# EAGLE design type-1 4 button v4 (EAGLE 9.6.2)
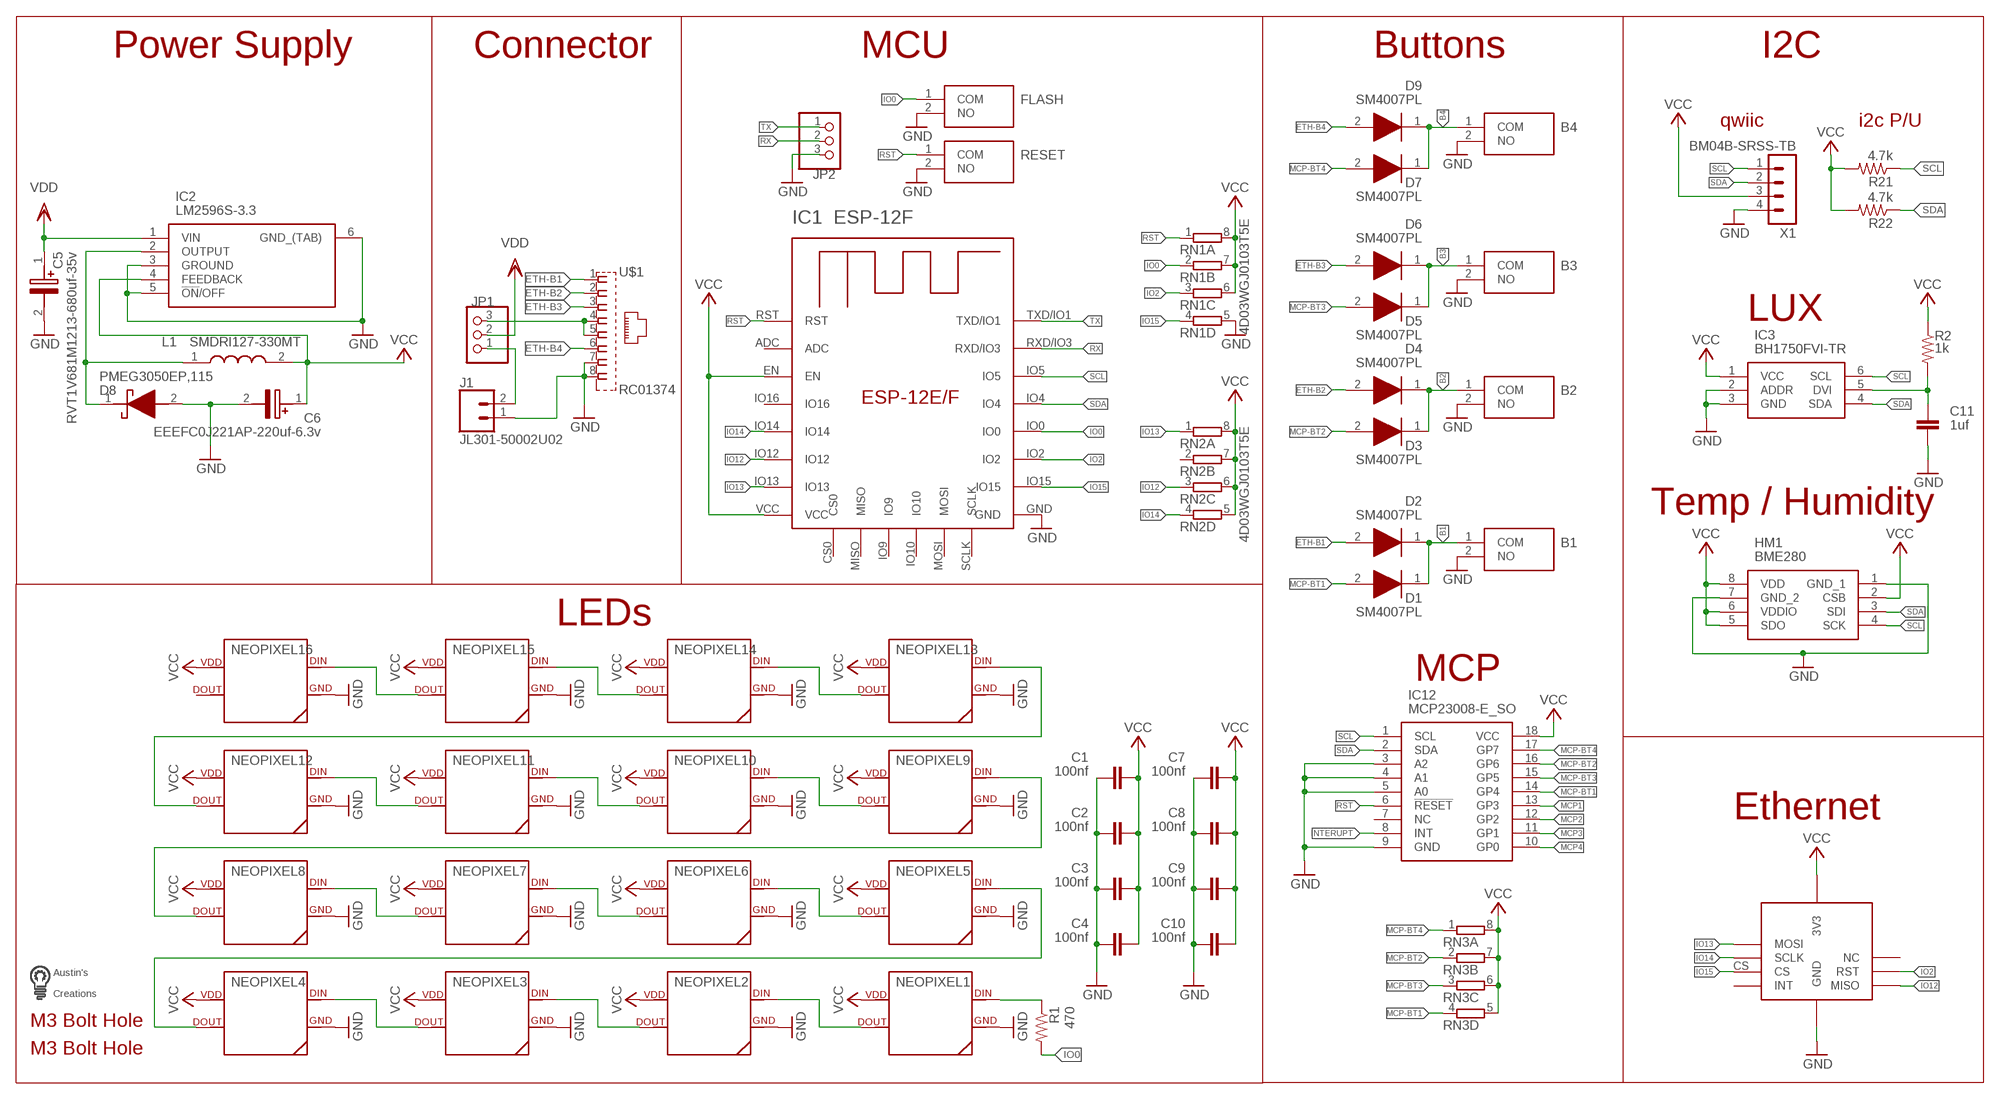
[diagram p0: schematic, sheet 1]

## Parts
B1  PTS636_SM25F_SMTR_LFS  [PTS636SM25FSMTRLFS]
B2  PTS636_SM25F_SMTR_LFS  [PTS636SM25FSMTRLFS]
B3  PTS636_SM25F_SMTR_LFS  [PTS636SM25FSMTRLFS]
B4  PTS636_SM25F_SMTR_LFS  [PTS636SM25FSMTRLFS]
C1  100nf  C-EUC0603  [C0603]
C2  100nf  C-EUC0603  [C0603]
C3  100nf  C-EUC0603  [C0603]
C4  100nf  C-EUC0603  [C0603]
C5  RVT1V681M1213-680uf-35v  EEE-HD1V681AQ  [CAPAE1350X1400N]
C6  EEEFC0J221AP-220uf-6.3v  EEEFC0J221AP  [CAPAE830X650N]
C7  100nf  C-EUC0603  [C0603]
C8  100nf  C-EUC0603  [C0603]
C9  100nf  C-EUC0603  [C0603]
C10  100nf  C-EUC0603  [C0603]
C11  1uf  C-EUC0603  [C0603]
D1  SM4007PL  [SODFL3718X125N]
D2  SM4007PL  [SODFL3718X125N]
D3  SM4007PL  [SODFL3718X125N]
D4  SM4007PL  [SODFL3718X125N]
D5  SM4007PL  [SODFL3718X125N]
D6  SM4007PL  [SODFL3718X125N]
D7  SM4007PL  [SODFL3718X125N]
D8  PMEG3050EP,115  [PMEG3050EP115]
D9  SM4007PL  [SODFL3718X125N]
FLASH  PTS636_SM25F_SMTR_LFS  [PTS636SM25FSMTRLFS]
HM1  BME280  [BME280]
IC1  ESP-12F  ESP-12E/F  [ESP-12E]
IC2  LM2596S-3.3  LM2596S-3.3_NOPB  [TO170P1435X465-6N]
IC3  BH1750FVI-TR  [WSOF6]
IC12  MCP23008-E_SO  [SOIC127P1030X265-18N]
J1  JL301-50002U02  2PINBLOCK  [SCREWTERMINAL-5MM-2]
JP1  PINHD-1X3  [1X03]
JP2  PINHD-1X3  [1X03]
L1  SMDRI127-330MT  CDRH127_LDNP-330MC  [INDPM120120X800N]
NEOPIXEL1  SK6812NEOPIXEL5050  [SK6812]
NEOPIXEL2  SK6812NEOPIXEL5050  [SK6812]
NEOPIXEL3  SK6812NEOPIXEL5050  [SK6812]
NEOPIXEL4  SK6812NEOPIXEL5050  [SK6812]
NEOPIXEL5  SK6812NEOPIXEL5050  [SK6812]
NEOPIXEL6  SK6812NEOPIXEL5050  [SK6812]
NEOPIXEL7  SK6812NEOPIXEL5050  [SK6812]
NEOPIXEL8  SK6812NEOPIXEL5050  [SK6812]
NEOPIXEL9  SK6812NEOPIXEL5050  [SK6812]
NEOPIXEL10  SK6812NEOPIXEL5050  [SK6812]
NEOPIXEL11  SK6812NEOPIXEL5050  [SK6812]
NEOPIXEL12  SK6812NEOPIXEL5050  [SK6812]
NEOPIXEL13  SK6812NEOPIXEL5050  [SK6812]
NEOPIXEL14  SK6812NEOPIXEL5050  [SK6812]
NEOPIXEL15  SK6812NEOPIXEL5050  [SK6812]
NEOPIXEL16  SK6812NEOPIXEL5050  [SK6812]
R1  470  R-US_R0603  [R0603]
R2  1k  R-US_R0603  [R0603]
R21  4.7k  R-US_R0603  [R0603]
R22  4.7k  R-US_R0603  [R0603]
RESET  PTS636_SM25F_SMTR_LFS  [PTS636SM25FSMTRLFS]
RN1  4R-N0603-ARC  [0603-ARC]
RN2  4R-N0603-ARC  [0603-ARC]
RN3  4R-N0603-ARC  [0603-ARC]
U$1  RC01374  [RC01374]
U$3  W5500MODULE  [W5500MODULE]
U$4  M3BOLTHOLE  [M3BOLTHOLE]
U$5  M3BOLTHOLE  [M3BOLTHOLE]
U$6  LOGOMED  [LOGOMED]
X1  BM04B-SRSS-TB  [BM04B-SRSS-TB]

## Nets
B1: B1.1(COM) D1.1(K) D2.1(K)
B2: B2.1(COM) D3.1(K) D4.1(K)
B3: B3.1(COM) D5.1(K) D6.1(K)
B4: B4.1(COM) D7.1(K) D9.1(K)
ETH-B1: D2.2(A) U$1.1
ETH-B2: D4.2(A) U$1.2
ETH-B3: D6.2(A) U$1.3
ETH-B4: D9.2(A) U$1.6
GND: B1.2(NO) B2.2(NO) B3.2(NO) B4.2(NO) C1.1 C2.1 C3.1 C4.1 C5.2(-) C6.2(-) C7.1 C8.1 C9.1 C10.1 C11.2 D8.2(A) FLASH.2(NO) HM1.1(GND_1) HM1.7(GND_2) IC1.GND IC2.3(GROUND) IC2.5(!ON!/OFF) IC2.6(GND_(TAB)) IC3.2(ADDR) IC3.3(GND) IC12.3(A2) IC12.4(A1) IC12.5(A0) IC12.9(GND) J1.1 JP2.3 NEOPIXEL1.3(GND) NEOPIXEL2.3(GND) NEOPIXEL3.3(GND) NEOPIXEL4.3(GND) NEOPIXEL5.3(GND) NEOPIXEL6.3(GND) NEOPIXEL7.3(GND) NEOPIXEL8.3(GND) NEOPIXEL9.3(GND) NEOPIXEL10.3(GND) NEOPIXEL11.3(GND) NEOPIXEL12.3(GND) NEOPIXEL13.3(GND) NEOPIXEL14.3(GND) NEOPIXEL15.3(GND) NEOPIXEL16.3(GND) RESET.2(NO) RN1.5 U$1.7 U$1.8 U$3.GND1(GND) U$3.GND2(GND) U$3.GND3(GND) X1.4
INTERUPT: IC12.8(INT)
IO0: FLASH.1(COM) IC1.IO0 R1.2 RN1.2
IO2: IC1.IO2 RN1.3 U$3.RST
IO12: IC1.IO12 RN2.3 U$3.MISO
IO13: IC1.IO13 RN2.1 U$3.MOSI
IO14: IC1.IO14 RN2.4 U$3.SCLK
IO15: IC1.IO15 RN1.4 U$3.CS
MCP1: IC12.13(GP3)
MCP2: IC12.12(GP2)
MCP3: IC12.11(GP1)
MCP4: IC12.10(GP0)
MCP-BT1: D1.2(A) IC12.14(GP4) RN3.4
MCP-BT2: D3.2(A) IC12.16(GP6) RN3.2
MCP-BT3: D5.2(A) IC12.15(GP5) RN3.3
MCP-BT4: D7.2(A) IC12.17(GP7) RN3.1
N$1: NEOPIXEL1.4(DIN) R1.1
N$2: NEOPIXEL1.2(DOUT) NEOPIXEL2.4(DIN)
N$3: NEOPIXEL2.2(DOUT) NEOPIXEL3.4(DIN)
N$4: NEOPIXEL3.2(DOUT) NEOPIXEL4.4(DIN)
N$5: NEOPIXEL4.2(DOUT) NEOPIXEL5.4(DIN)
N$6: NEOPIXEL8.2(DOUT) NEOPIXEL9.4(DIN)
N$7: NEOPIXEL12.2(DOUT) NEOPIXEL13.4(DIN)
N$8: NEOPIXEL5.2(DOUT) NEOPIXEL6.4(DIN)
N$9: NEOPIXEL9.2(DOUT) NEOPIXEL10.4(DIN)
N$10: NEOPIXEL13.2(DOUT) NEOPIXEL14.4(DIN)
N$11: NEOPIXEL6.2(DOUT) NEOPIXEL7.4(DIN)
N$12: NEOPIXEL10.2(DOUT) NEOPIXEL11.4(DIN)
N$13: NEOPIXEL14.2(DOUT) NEOPIXEL15.4(DIN)
N$14: NEOPIXEL7.2(DOUT) NEOPIXEL8.4(DIN)
N$15: NEOPIXEL11.2(DOUT) NEOPIXEL12.4(DIN)
N$16: NEOPIXEL15.2(DOUT) NEOPIXEL16.4(DIN)
N$17: JP1.3 U$1.4 U$1.5
N$18: J1.2 JP1.1
N$20: D8.1(K) IC2.2(OUTPUT) L1.1
N$21: C11.1 IC3.5(DVI) R2.2
RST: IC1.RST IC12.6(!RESET) RESET.1(COM) RN1.1
RX: IC1.RXD/IO3 JP2.2
SCL: HM1.4(SCK) IC1.IO5 IC3.6(SCL) IC12.1(SCL) R21.1 X1.1
SDA: HM1.3(SDI) IC1.IO4 IC3.4(SDA) IC12.2(SDA) R22.1 X1.2
TX: IC1.TXD/IO1 JP2.1
VCC: C1.2 C2.2 C3.2 C4.2 C6.1(+) C7.2 C8.2 C9.2 C10.2 HM1.2(CSB) HM1.5(SDO) HM1.6(VDDIO) HM1.8(VDD) IC1.EN IC1.VCC IC2.4(FEEDBACK) IC3.1(VCC) IC12.18(VCC) L1.2 NEOPIXEL1.1(VDD) NEOPIXEL2.1(VDD) NEOPIXEL3.1(VDD) NEOPIXEL4.1(VDD) NEOPIXEL5.1(VDD) NEOPIXEL6.1(VDD) NEOPIXEL7.1(VDD) NEOPIXEL8.1(VDD) NEOPIXEL9.1(VDD) NEOPIXEL10.1(VDD) NEOPIXEL11.1(VDD) NEOPIXEL12.1(VDD) NEOPIXEL13.1(VDD) NEOPIXEL14.1(VDD) NEOPIXEL15.1(VDD) NEOPIXEL16.1(VDD) R2.1 R21.2 R22.2 RN1.6 RN1.7 RN1.8 RN2.5 RN2.6 RN2.7 RN2.8 RN3.5 RN3.6 RN3.7 RN3.8 U$3.3V3_1(3V3) U$3.3V3_2(3V3) X1.3
VDD: C5.1(+) IC2.1(VIN) JP1.2
Unconnected: IC1.ADC IC1.CS0 IC1.IO9 IC1.IO10 IC1.IO16 IC1.MISO IC1.MOSI IC1.SCLK IC12.7(NC) NEOPIXEL16.2(DOUT) RN2.2 U$3.INT U$3.NC

## Notes on the sheet
- Power Supply | Connector | MCU | Buttons | I2C
- qwiic | i2c P/U
- LUX
- 4D03WGJ0103T5E
- Temp / Humidity
- 4D03WGJ0103T5E
- LEDs
- MCP
- Ethernet

## Library data of the parts
B1-B4 FLASH RESET = SamacSys_Parts:PTS636_SM25F_SMTR_LFS: Tactile Switches Tact 50mA 12VDC, 6.0x3.5, 2.5mm H, 180gf, F leads, No ground pin, White Actuator Source: Datasheet <https://ms.componentsearchengine.com/Datasheets/1/PTS636 SM25F SMTR LFS.pdf>; ARROW_PART_NUMBER: PTS636 SM25F SMTR LFS; ARROW_PRICE-STOCK: https://www.arrow.com/en/products/pts636-sm25f-smtr-lfs/ck; DESCRIPTION: Tactile Switches Tact 50mA 12VDC, 6.0x3.5, 2.5mm H, 180gf, F leads, No ground pin, White Actuator; HEIGHT: 2.7mm; MANUFACTURER_NAME: C & K COMPONENTS; MANUFACTURER_PART_NUMBER: PTS636 SM25F SMTR LFS; MOUSER_PART_NUMBER: 611-PTS636SM25FSMTRL; MOUSER_PRICE-STOCK: https://www.mouser.co.uk/ProductDetail/CK/PTS636-SM25F-SMTR-LFS?qs=vLWxofP3U2wcBTQSwfMFOw%3D%3D
C1-C4 C7-C11 = rcl:C-EU: CAPACITOR, European symbol; SPICEPREFIX: C
C5 = SamacSys_Parts:EEE-HD1V681AQ: Aluminium Electrolytic Capacitors - SMD 35VDC 680uF 20% AEC-Q200 Source: Datasheet <https://industrial.panasonic.com/cdbs/www-data/pdf/RDE0000/ABA0000C1166.pdf>; DESCRIPTION: Aluminium Electrolytic Capacitors - SMD 35VDC 680uF 20% AEC-Q200; HEIGHT: 14mm; MANUFACTURER_NAME: Panasonic; MANUFACTURER_PART_NUMBER: EEE-HD1V681AQ; MOUSER_PART_NUMBER: 667-EEE-HD1V681AQ; MOUSER_PRICE-STOCK: https://www.mouser.co.uk/ProductDetail/Panasonic/EEE-HD1V681AQ?qs=w%2Fv1CP2dgqoW7i2Hoqi%252B9w%3D%3D
C6 = SamacSys_Parts:EEEFC0J221AP: PANASONIC - EEEFC0J221AP - SMD Aluminium Electrolytic Capacitor, Radial Can - SMD, 220 F, 6.3 V, EEEFC Series Source: Datasheet <https://industrial.panasonic.com/cdbs/www-data/pdf/RDE0000/ABA0000C1169.pdf>; DESCRIPTION: PANASONIC - EEEFC0J221AP - SMD Aluminium Electrolytic Capacitor, Radial Can - SMD, 220 F, 6.3 V, EEEFC Series; HEIGHT: 6.5mm; MANUFACTURER_NAME: Panasonic; MANUFACTURER_PART_NUMBER: EEEFC0J221AP
D1-D7 D9 = SamacSys_Parts:SM4007PL: 1kV 1A 1.1V @ 1A SOD-123FL Diodes - General Purpose RoHS Source: Datasheet <https://datasheet.lcsc.com/szlcsc/1903051030_MDD-Jiangsu-Yutai-Elec-SM4007PL_C64898.pdf>; DESCRIPTION: 1kV 1A 1.1V @ 1A SOD-123FL Diodes - General Purpose RoHS; HEIGHT: 1.25mm; MANUFACTURER_NAME: MDD(Microdiode Electronics); MANUFACTURER_PART_NUMBER: SM4007PL
D8 = SamacSys_Parts:PMEG3050EP,115: NXP PMEG3050EP,115 SMT Schottky Diode, 30V 5A, 2-Pin SOD-128 Source: Datasheet <https://docs-emea.rs-online.com/webdocs/14cd/0900766b814cd012.pdf>; ARROW_PART_NUMBER: PMEG3050EP,115; ARROW_PRICE-STOCK: https://www.arrow.com/en/products/pmeg3050ep115/nexperia; DESCRIPTION: NXP PMEG3050EP,115 SMT Schottky Diode, 30V 5A, 2-Pin SOD-128; HEIGHT: 1mm; MANUFACTURER_NAME: Nexperia; MANUFACTURER_PART_NUMBER: PMEG3050EP,115; MOUSER_PART_NUMBER: 771-PMEG3050EP115; MOUSER_PRICE-STOCK: https://www.mouser.co.uk/ProductDetail/Nexperia/PMEG3050EP115?qs=GcY6OjH1zdmnjQ%2FhUT5aOA%3D%3D
HM1 = custom parts:BME280: Board Mount Humidity Sensors Source: Datasheet <http://ae-bst.resource.bosch.com/media/products/dokumente/bme280/BST-BME280_DS001-11.pdf>; DESCRIPTION: Board Mount Humidity Sensors; HEIGHT: mm; MANUFACTURER_NAME: Bosch Sensortec; MANUFACTURER_PART_NUMBER: BME280; MOUSER_PART_NUMBER: 262-BME280; MOUSER_PRICE-STOCK: https://www.mouser.co.uk/ProductDetail/Bosch-Sensortec/BME280?qs=2OnyuXx6vpj2fK9HX7qb3g%3D%3D
IC1 = custom parts:ESP-12E/F
IC2 = SamacSys_Parts:LM2596S-3.3_NOPB: SIMPLE SWITCHER® 4.5V to 40V, 3A Low Component Count Step-Down Regulator Source: Datasheet <http://www.ti.com/lit/ds/symlink/lm2596.pdf>; DESCRIPTION: SIMPLE SWITCHER&#174; 4.5V to 40V, 3A Low Component Count Step-Down Regulator; HEIGHT: 4.65mm; MANUFACTURER_NAME: Texas Instruments; MANUFACTURER_PART_NUMBER: LM2596S-3.3/NOPB; MOUSER_PART_NUMBER: 926-LM2596S-3.3/NOPB; MOUSER_PRICE-STOCK: https://www.mouser.co.uk/ProductDetail/Texas-Instruments/LM2596S-33-NOPB?qs=X1J7HmVL2ZHsEwG9Q6doow%3D%3D
IC3 = custom parts:BH1750FVI-TR: Ambient Light Sensor,16bit,I2C,WSOF6I ROHM BH1750FVI-TR Ambient Light Sensor Unit Surface Mount Source: Datasheet <https://componentsearchengine.com/Datasheets/2/BH1750FVI-TR.pdf>; DESCRIPTION: Ambient Light Sensor,16bit,I2C,WSOF6I ROHM BH1750FVI-TR Ambient Light Sensor Unit Surface Mount; HEIGHT: mm; MANUFACTURER_NAME: ROHM Semiconductor; MANUFACTURER_PART_NUMBER: BH1750FVI-TR; MOUSER_PART_NUMBER: 755-BH1750FVI-TR; MOUSER_PRICE-STOCK: https://www.mouser.co.uk/ProductDetail/ROHM-Semiconductor/BH1750FVI-TR?qs=phc6PQ%252BTPUNy88lRCs6mVA%3D%3D
IC12 = SamacSys_Parts:MCP23008-E_SO: 8-bit I/O Expander,I2C,MCP23008-E/SO Source: Datasheet <http://docs-emea.rs-online.com/webdocs/0a78/0900766b80a784b7.pdf>; ARROW_PART_NUMBER: MCP23008-E/SO; ARROW_PRICE-STOCK: https://www.arrow.com/en/products/mcp23008-eso/microchip-technology; DESCRIPTION: 8-bit I/O Expander,I2C,MCP23008-E/SO; HEIGHT: 2.65mm; MANUFACTURER_NAME: Microchip; MANUFACTURER_PART_NUMBER: MCP23008-E/SO; MOUSER_PART_NUMBER: 579-MCP23008-E/SO; MOUSER_PRICE-STOCK: https://www.mouser.co.uk/ProductDetail/Microchip-Technology/MCP23008-E-SO?qs=Sez7gRs8XSWum74ZwQXTLw%3D%3D
J1 = custom parts:2PINBLOCK
JP1 JP2 = custom parts:PINHD-1X3: PIN HEADER
L1 = SamacSys_Parts:CDRH127_LDNP-330MC: Fixed Inductors 33uH 3.9A Source: Datasheet <https://products.sumida.com/products/pdf/CDRH127LD.pdf>; DESCRIPTION: Fixed Inductors 33uH 3.9A; HEIGHT: 8mm; MANUFACTURER_NAME: Sumida; MANUFACTURER_PART_NUMBER: CDRH127/LDNP-330MC; MOUSER_PART_NUMBER: 851-CDRH127LDNP330MC; MOUSER_PRICE-STOCK: https://www.mouser.co.uk/ProductDetail/Sumida/CDRH127-LDNP-330MC?qs=rZntyWl5IYHj3wgmnQ0WOg%3D%3D
NEOPIXEL1-NEOPIXEL16 = custom parts:SK6812: for 5050 sk6812 LED
R1 R2 = resistor:R-US_: RESISTOR, American symbol
R21 R22 = rcl:R-US_: RESISTOR, American symbol; SPICEPREFIX: R
RN1-RN3 = custom parts:4R-N: Array Chip Resistor Source: RS Component / Phycomp; OC_FARNELL: unknown; OC_NEWARK: unknown
U$1 = custom parts:RC01374
U$3 = custom parts:W5500MODULE
U$4 U$5 = custom parts:M3BOLTHOLE
U$6 = custom parts:LOGOMED
X1 = custom parts:BM04B-SRSS: JST SH series header 1.00mm pitch disconnectable crimp style connectors, vertical (side entry type), 4 pins

## Board
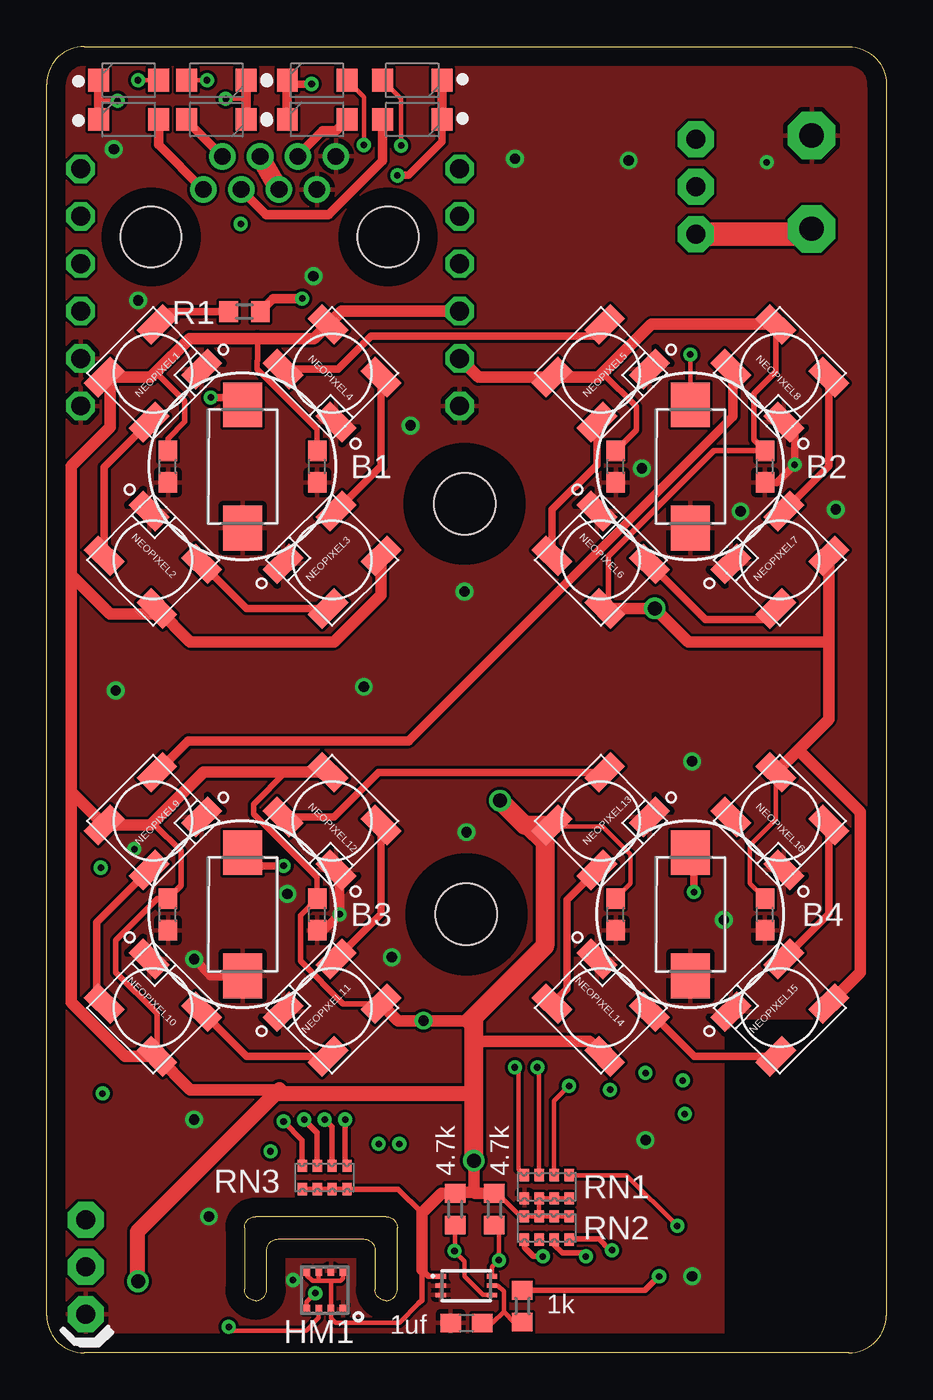
[diagram p1: board, top side]
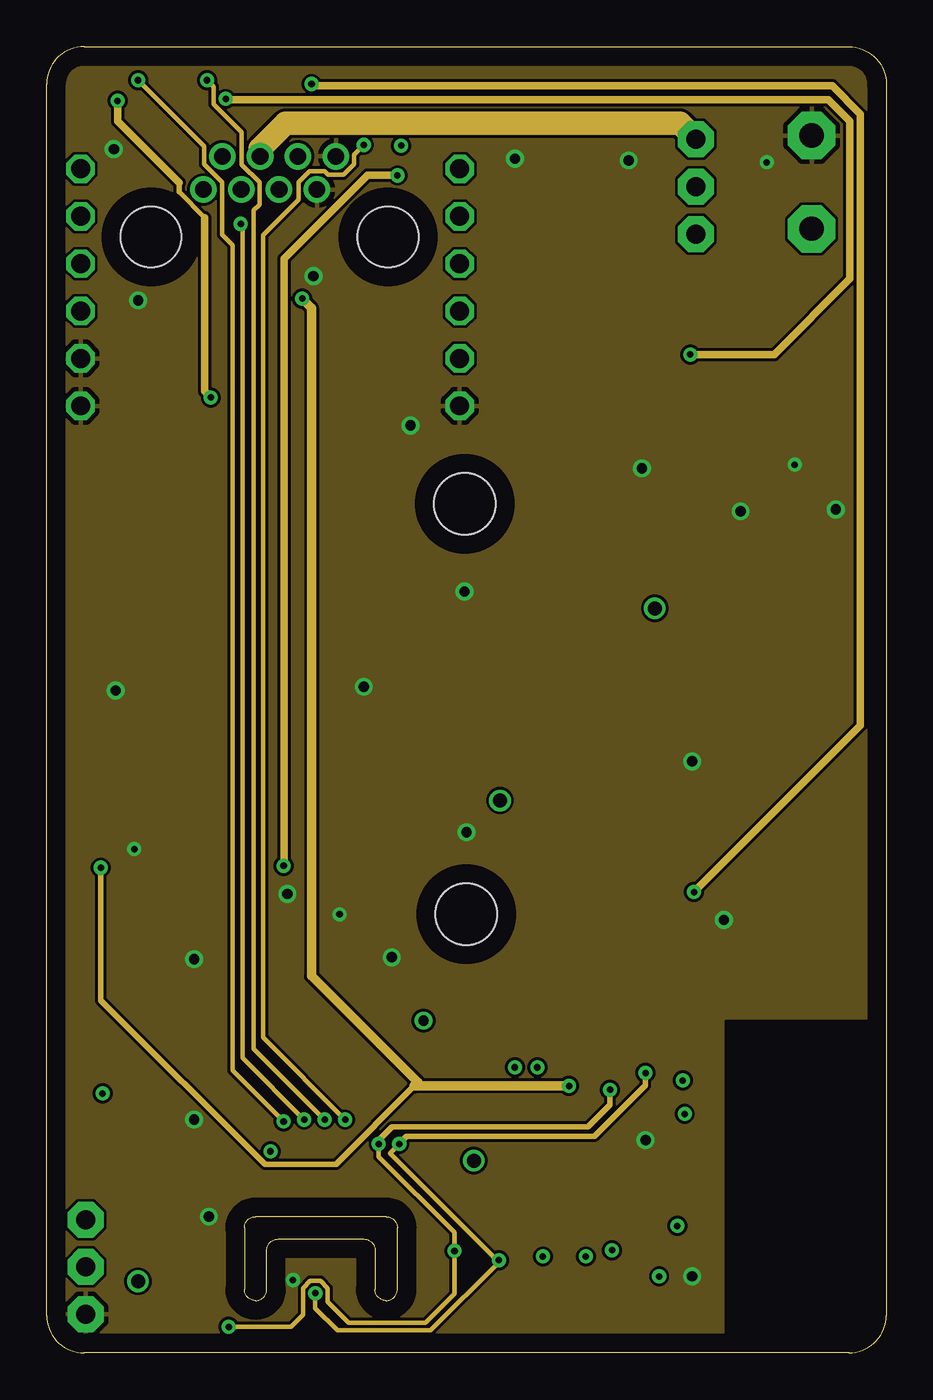
[diagram p2: board, inner layer Route2]
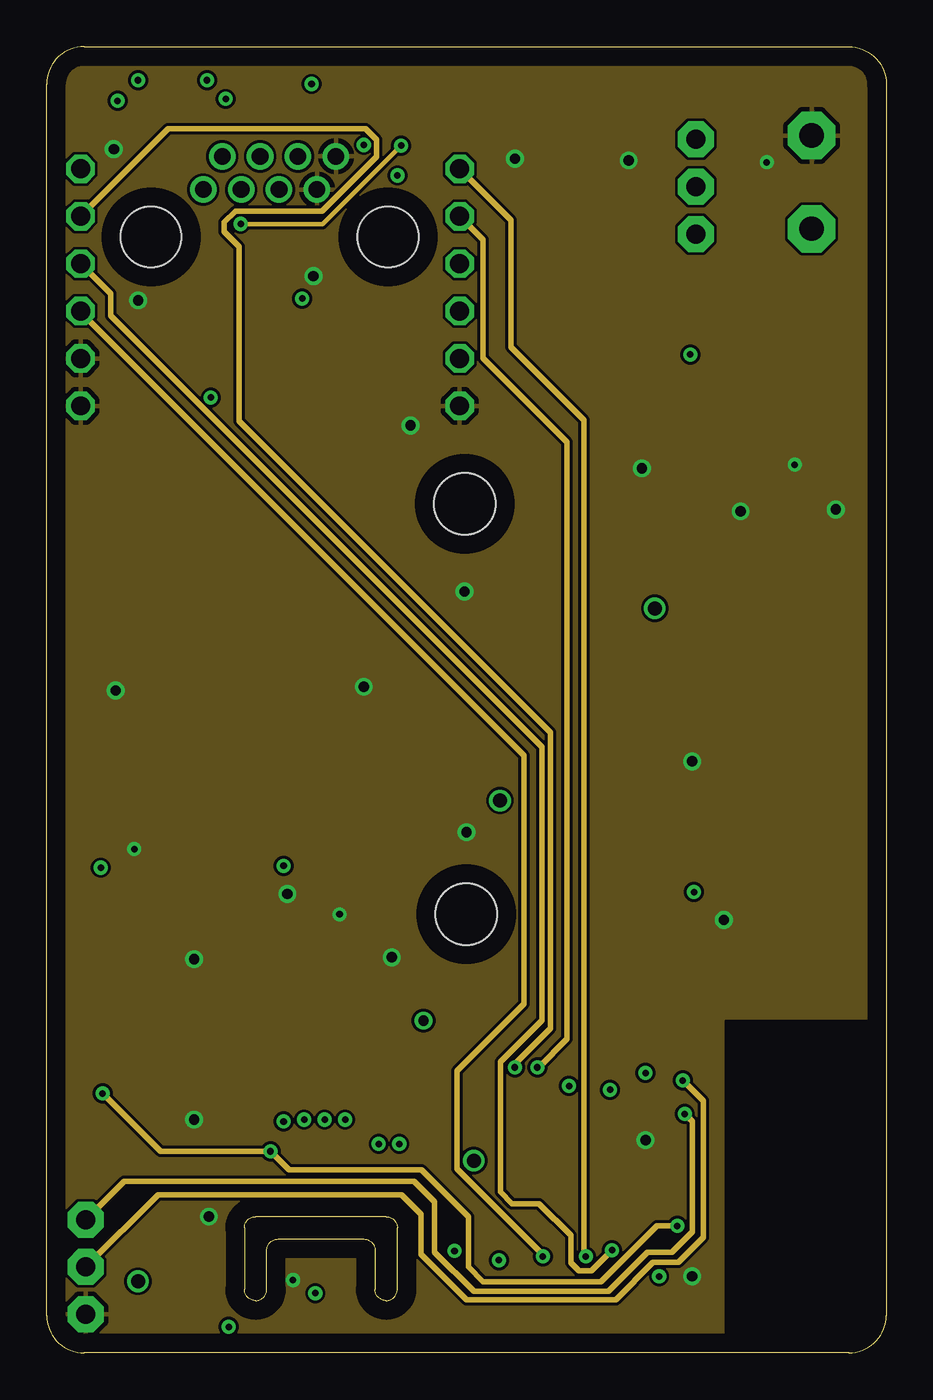
[diagram p3: board, inner layer Route15]
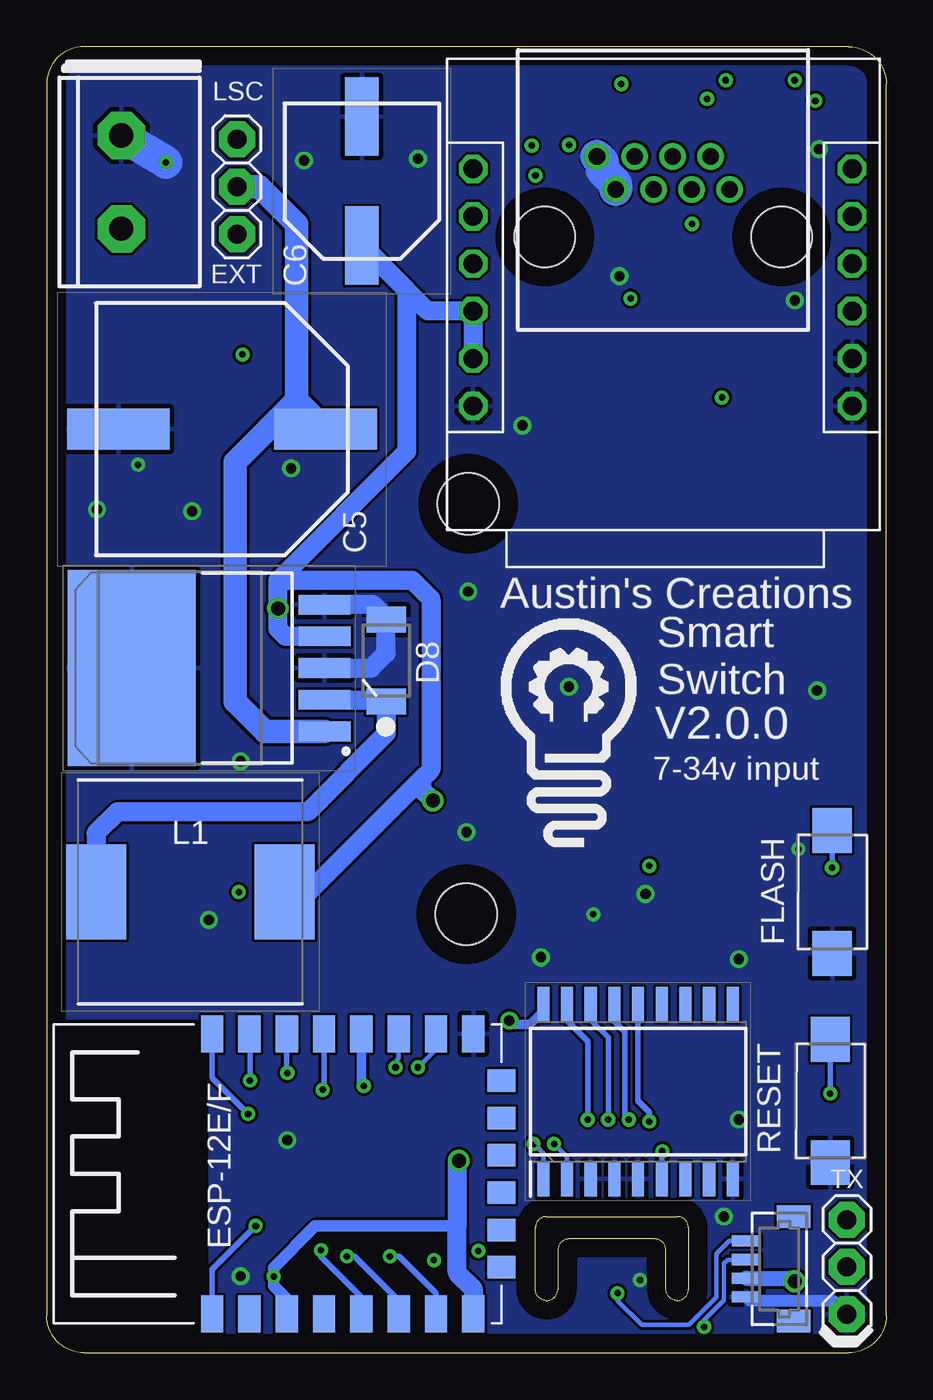
[diagram p4: board, bottom side, seen from below]

Size 45 x 70 mm. Coordinates in mm from the lower left corner, seen from the top.
Outline: 0,2 0,68 arc-90 2,70 43,70 arc-90 45,68 45,2 arc-90 43,0 2,0 arc-90 0,2
Outline: 11.8,3.4 11.8,5.5 arc-90 12.4,6.1 17,6.1 arc-90 17.6,5.5 17.6,3.4 arc90 18.2,2.8 arc90 18.8,3.4 18.8,6.7 arc90 18.2,7.3 11.2,7.3 arc90 10.6,6.7 10.6,3.4 arc90 11.2,2.8 arc90 11.8,3.4
Copper layers (1+2*15+16): Top 0.035mm / dielectric 0.53mm / Route2 0.035mm / dielectric 0.4mm / Route15 0.035mm / dielectric 0.53mm / Bottom 0.035mm
Design rules "default *": minimum track width 9mil, minimum drill 0.35mm, track to track 6mil, track to pad 6mil, pad to pad 6mil, via to via 6mil, smd to smd 6mil, copper to edge 40mil, drill to drill 6mil, minimum pad ring 10mil, minimum via ring 8mil, stop-mask expansion 4mil, vias tented up to drill 0mil, thermal gap 10mil
tRestrict: area 36.4,0.2 to 44.7,17.8
bRestrict: area 36.4,0.2 to 44.7,17.8
vRestrict: area 26.4,0.7 to 43.9,8.2

### Footprints (pad centres in the part's own frame; a part is rotated, then mirrored left to right if it is on the bottom)
PTS636SM25FSMTRLFS = smd 2.4 x 2.1: 1 -3.3,0; 2 3.3,0
C0603 = smd 1.1 x 1: 1 -0.85,0; 2 0.85,0
CAPAE1350X1400N = smd 5.5 x 2.2: 1 -5.55,0; 2 5.55,0
CAPAE830X650N = smd 4.2 x 1.8: 1 -3.45,0; 2 3.45,0
SODFL3718X125N = smd 1.12 x 1.22: 1 -1.6,0; 2 1.6,0
PMEG3050EP115 = smd 1.4 x 2.1: 1 -2.2,0; 2 2.2,0
BME280 = smd 0.5 x 0.35: 1 2.05,0; 2 2.05,-0.65; 3 2.05,-1.3; 4 2.05,-1.95; 5 0,-1.95; 6 0,-1.3; 7 0,-0.65; 8 0,0
ESP-12E = smd 2 x 1.2: ADC -7.46,5.53; EN -7.46,3.53; GND 7.54,-6.47; IO0 7.54,-0.47; IO2 7.54,-2.47; IO4 7.54,1.53; IO5 7.54,3.53; IO12 -7.46,-2.47; IO13 -7.46,-4.47; IO14 -7.46,-0.47; IO15 7.54,-4.47; IO16 -7.46,1.53; RST -7.46,7.53; RXD/IO3 7.54,5.53; TXD/IO1 7.54,7.53; VCC -7.46,-6.47 | smd 1.2 x 1.5: CS0 -4.96,-7.97; IO9 -0.96,-7.97; IO10 1.04,-7.97; MISO -2.96,-7.97; MOSI 3.04,-7.97; SCLK 5.04,-7.97
TO170P1435X465-6N = smd 2.8 x 1.05: 1 -6.2,3.4; 2 -6.2,1.7; 3 -6.2,0; 4 -6.2,-1.7; 5 -6.2,-3.4 | smd 6.85 x 10.5: 6 4.15,0
WSOF6 = smd 0.55 x 0.25: 1 -1.375,0.5; 2 -1.375,0; 3 -1.375,-0.5; 4 1.375,-0.5; 5 1.375,0; 6 1.375,0.5
SOIC127P1030X265-18N = smd 1.85 x 0.65: 1 -4.675,5.08; 2 -4.675,3.81; 3 -4.675,2.54; 4 -4.675,1.27; 5 -4.675,0; 6 -4.675,-1.27; 7 -4.675,-2.54; 8 -4.675,-3.81; 9 -4.675,-5.08; 10 4.675,-5.08; 11 4.675,-3.81; 12 4.675,-2.54; 13 4.675,-1.27; 14 4.675,0; 15 4.675,1.27; 16 4.675,2.54; 17 4.675,3.81; 18 4.675,5.08
SCREWTERMINAL-5MM-2 = drill 1.3 pad 2.54 octagon: 1 -2.54,0; 2 2.46,0
1X03 = drill 1.016 pad 1.93 octagon: 1 -2.54,0; 2 0,0; 3 2.54,0
INDPM120120X800N = smd 3.2 x 5.1: 1 -5.05,0; 2 5.05,0
SK6812 = smd 2 x 1.1: 1 -2,1.7; 2 -2,-1.7; 3 2,-1.7; 4 2,1.7
R0603 = smd 1 x 1.1: 1 -0.85,0; 2 0.85,0
0603-ARC = smd 0.5 x 0.65: 1 -1.2,-0.625; 2 -0.4,-0.625; 3 0.4,-0.625; 4 1.2,-0.625; 5 1.2,0.625; 6 0.4,0.625; 7 -0.4,0.625; 8 -1.2,0.625
RC01374 = drill 0.889 pad 1.422: 1 3.556,2.54; 2 2.54,4.318; 3 1.524,2.54; 4 0.508,4.318; 5 -0.508,2.54; 6 -1.524,4.318; 7 -2.54,2.54; 8 -3.556,4.318 | hole 3.251: 6.35,0; -6.35,0
W5500MODULE = drill 1.016 pad 1.346 octagon: 3V3_1 21.79,-9.19; 3V3_2 21.79,-11.73; CS 1.47,-16.81; GND1 21.79,-6.65; GND2 1.47,-6.65; GND3 1.47,-9.19; INT 1.47,-19.35; MISO 21.79,-19.35; MOSI 1.47,-11.73; NC 21.79,-14.27; RST 21.79,-16.81; SCLK 1.47,-14.27
M3BOLTHOLE = hole 3.3: 0,0
BM04B-SRSS-TB = smd 0.6 x 1.55: 1 1.5,0; 2 0.5,0; 3 -0.5,0; 4 -1.5,0 | smd 1.2 x 1.8: M1 2.8,-2.525; M2 -2.8,-2.525

### Placement (x,y rotation side)
B1  10.5,47.5 270 top
B2  34.5,47.5 270 top
B3  10.5,23.5 270 top
B4  34.5,23.5 270 top
C1  6.5,47.5 90 top
C2  30.5,47.5 90 top
C3  6.5,23.5 90 top
C4  30.5,23.5 90 top
C5  35.6,49.5 180 bottom
C6  28.1,62.8 90 bottom
C7  14.5,23.5 90 top
C8  38.5,23.5 90 top
C9  14.5,47.5 90 top
C10  38.5,47.5 90 top
C11  22.5,1.6 180 top
D1  4.4,68.2 0 top
D2  4.4,66.1 0 top
D3  9.1,68.2 180 top
D4  9.1,66.1 180 top
D5  19.6,68.2 180 top
D6  19.6,66.1 180 top
D7  14.5,68.2 0 top
D8  26.8,37.1 90 bottom
D9  14.5,66.1 0 top
FLASH  2.9,24.7 270 bottom
HM1  15.88,4.38 270 top
IC1  28.6,9.55 90 bottom
IC2  36.3,36.7 180 bottom
IC3  22.5,3.6 0 top
IC12  13.3,14 90 bottom
J1  41,62.7 270 bottom
JP1  34.8,62.5 90 bottom
JP2  2.1,4.6 270 bottom
L1  37.3,24.7 0 bottom
NEOPIXEL1  5.7,52.5 45 top
NEOPIXEL2  5.7,42.5 135 top
NEOPIXEL3  15.3,42.5 225 top
NEOPIXEL4  15.3,52.5 315 top
NEOPIXEL5  29.7,52.5 45 top
NEOPIXEL6  29.7,42.5 135 top
NEOPIXEL7  39.3,42.5 225 top
NEOPIXEL8  39.3,52.5 315 top
NEOPIXEL9  5.7,28.5 45 top
NEOPIXEL10  5.7,18.5 135 top
NEOPIXEL11  15.3,18.5 225 top
NEOPIXEL12  15.3,28.5 315 top
NEOPIXEL13  29.7,28.5 45 top
NEOPIXEL14  29.7,18.5 135 top
NEOPIXEL15  39.3,18.5 225 top
NEOPIXEL16  39.3,28.5 315 top
R1  10.6,55.8 0 top
R2  25.5,2.5 270 top
R21  24,7.7 90 top
R22  21.9,7.7 90 top
RESET  3,13.5 270 bottom
RN1  26.8,8.9 180 top
RN2  26.8,6.7 0 top
RN3  14.9,9.4 180 top
U$1  11.95,59.8 0 bottom
U$3  0.35,44.1 180 bottom
U$4  22.4,45.5 0 top
U$5  22.5,23.5 0 top
U$6  21.3,26.8 0 bottom
X1  7.5,4.5 90 bottom

### Tracks (layer width: path | path; a pad name or v marks a point on that pad's centre or on a via)
B1  (via drill 0.35)
  Top 0.254: 2.8,67.1 v3.8,67.1
  Top 0.406: v8.8,51.2 10.1,51.2 B1.1
  Top 0.508: D1.1 2.8,67.1 D2.1
  Route2 0.254: 8.47,60.85 7.1,62.22
  Route2 0.305: 7.1,62.22 7.1,62.7
  Route2 0.406: 8.47,60.85 8.47,51.53 v8.8,51.2 | v3.8,67.1 3.8,66 7.1,62.7
B2  (via drill 0.35)
  Top 0.254: 10.7,67.2 v9.6,67.2 | B2.1 v34.5,53.5
  Top 0.508: D3.1 10.7,67.2 D4.1
  Route2 0.406: v9.6,67.2 9.64,67.16 41.9,67.16 43.06,66 43.06,57.56 39,53.5 v34.5,53.5
B3  (via drill 0.35)
  Top 0.406: D6.1 21.2,64.9 19.4,63.1 v18.8,63.1 | B3.1 11.2,26.1 v12.7,26.1
  Top 0.508: D5.1 D6.1
  Route2 0.406: v18.8,63.1 17.2,63.1 12.73,58.63 12.73,26.13 v12.7,26.1
B4  (via drill 0.35)
  Top 0.406: 12.9,68 v14.2,68 | B4.1 34.7,26.6 v34.7,24.7
  Top 0.508: D7.1 12.9,68 D9.1
  Route2 0.406: v34.7,24.7 43.62,33.62 43.62,66.38 42.1,67.9 14.3,67.9 v14.2,68
ETH-B1
  Top 0.508: D2.2 6,64.73 U$1.1
ETH-B2
  Top 0.508: D4.2 7.5,66.03 U$1.2
ETH-B3
  Top 0.508: U$1.3 11.77,61 15.1,61 18,63.9 D6.2
ETH-B4
  Top 0.508: D9.2 15.5,65.5 14.8,65.5 13.47,64.17 U$1.6
GND  (via drill 0.35, 0.55)
  Top 0.254: HM1.1 15.9,2.32
  Top 0.406: C10.1 39.15,46.65 v40.1,47.6 40.1,49.3 NEOPIXEL8.3
  Top 0.508: NEOPIXEL12.3 15.7,25.7 v15.7,23.5 14.85,22.65 C7.1 | B3.2 8.8,20.2 v7.9,21.1
  Bottom 0.61: X1.4 7.3,2.8 2.84,2.8 JP2.3
  Bottom 1.016: IC2.3 27.6,36.7 26.8,37.5 D8.2 26.8,39.4 27.5,40.1 IC2.5
  Bottom 1.778: U$1.8 15.23,63.84 15.23,63.39 14.49,62.66 U$1.7 | J1.1 v38.6,63.8
  other vias: 13.2,3.9 4.7,27 42.3,45.2 22.4,40.8 22.5,27.9 36.3,23.2 32.1,11.4 34.6,4.1 7.9,12.5 8.7,7.3 3.7,35.5 17,35.7 14.3,57.7 3.6,64.5 4.9,56.4 31.9,47.4 37.2,45.1 12.9,24.6 25.1,64 31.2,63.9 19.5,49.7 34.6,31.7 18.5,21.2
  pour Top: 0,68 arc-90 2,70 43.1,70 arc-90 45,68.1 45,1.9 arc-90 43.1,0 2,0 arc-90 0,2
  pour Route15: 0,68 arc-90 2,70 43.1,70 arc-90 45,68.1 45,1.9 arc-90 43.1,0 2,0 arc-90 0,2
  pour Route2: 0,68 arc-90 2,70 43.1,70 arc-90 45,68.1 45,1.9 arc-90 43.1,0 2,0 arc-90 0,2
  pour Bottom: 0,68 arc-90 2,70 43.1,70 arc-90 45,68.1 45,1.9 arc-90 43.1,0 2,0 arc-90 0,2
  cutout Route2: 43.8,17.8 44.7,17.8 44.7,1.4 43.5,0.2 36.4,0.2 36.4,17.7 36.4,17.8
  cutout Route15: 36.4,17.8 44.7,17.8 44.7,1.4 43.5,0.2 36.4,0.2
IO0  (via drill 0.35)
  Top 0.254: RN1.2 27.2,13.5 v28,14.3
  Top 0.508: v13.7,56.5 12.15,56.5 R1.2
  Route2 0.305: v2.9,26 2.9,18.9 11.7,10.1 15.5,10.1 19.7,14.3 19.9,14.5
  Route2 0.508: v28,14.3 19.7,14.3 | v13.7,56.5 14.2,56 14.2,20.2 19.9,14.5
  Bottom 0.305: FLASH.1 v2.9,26
  Bottom 0.508: IC1.IO0 28.13,14.43 v28,14.3
IO2  (via drill 0.35)
  Top 0.254: v26.3,15.3 26.4,15.2 RN1.3
  Route15 0.305: U$3.RST 23.4,59.65 23.4,53.3 27.9,48.8 27.9,16.82 26.38,15.3 v26.3,15.3
  Bottom 0.254: IC1.IO2 26.13,15.77 26.3,15.6 v26.3,15.3
IO12  (via drill 0.35)
  Top 0.305: v28.9,5.17 28.7,5.37 27.64,5.37 27.2,5.8 RN2.3
  Route15 0.305: U$3.MISO 24.9,60.69 24.9,53.9 28.8,50 28.8,5.26 v28.9,5.17
  Bottom 0.305: IC1.IO12 26.23,2.19 26.23,2.9 28.5,5.17 v28.9,5.17
IO13  (via drill 0.35)
  Top 0.305: RN2.1 25.6,5.67 26.1,5.17 v26.6,5.17
  Route15 0.305: v26.6,5.17 26.6,5.26 22,9.87 22,15.11 25.58,18.7 25.58,32.02 1.82,55.78 U$3.MOSI
  Bottom 0.305: IC1.IO13 24.13,3.19 26.1,5.17 v26.6,5.17
IO14  (via drill 0.35)
  Top 0.305: RN2.4 28.02,6.1 29.6,6.1 30.2,5.5 v30.3,5.5
  Route15 0.305: v30.3,5.5 29.2,4.4 28.53,4.4 28.1,4.83 28.1,6.3 26.4,8 24.93,8 24.32,8.62 24.32,15.58 26.54,17.81 26.54,32.46 3.42,55.58 3.42,56.77 U$3.SCLK
  Bottom 0.305: v30.3,5.5 30.3,5.16 28.13,2.99 IC1.IO14
IO15  (via drill 0.35)
  Top 0.254: RN1.4 25.3,9.82 25.3,15.1 v25.1,15.3
  Route15 0.305: U$3.CS 6.51,65.6 17.1,65.6 17.68,65.02 17.68,64.11 14.75,61.18 10.12,61.18 9.52,60.58 9.52,60.08 10.32,59.28 10.32,49.92 27,33.25 27,17.4 25.1,15.5 v25.1,15.3
  Bottom 0.254: IC1.IO15 24.13,16.27 v25.1,15.3
MCP-BT1  (via drill 0.35)
  Top 0.254: D1.2 v4.9,68.2
  Top 0.305: RN3.4 13.7,11.4 v12.7,12.4
  Route2 0.254: v4.9,68.2 8.43,64.67 8.43,63.71 9.4,62.74 9.4,59.93 9.96,59.37 9.96,15.14 v12.7,12.4
  Bottom 0.305: IC12.14 13.3,13.5 12.7,12.9 v12.7,12.4
MCP-BT2  (via drill 0.35)
  Top 0.254: D3.2 v8.6,68.2
  Top 0.305: RN3.2 15.3,12.1 v14.9,12.5
  Route2 0.254: v8.6,68.2 8.94,67.86 8.94,66.93 10.46,65.41 10.46,63.69 11.4,62.74 11.4,61.53 11.1,61.23 11.1,16.3 v14.9,12.5
  Bottom 0.305: v14.9,12.5 14.9,16.9 15.84,17.84 IC12.16
MCP-BT3  (via drill 0.35)
  Top 0.254: D5.2 19,67.2 v19,64.7
  Top 0.305: RN3.3 14.5,11.8 v13.8,12.5
  Route2 0.254: v13.8,12.5 10.49,15.81 10.49,60.41 v10.4,60.5
  Route15 0.254: v10.4,60.5 14.8,60.5 v19,64.7
  Bottom 0.305: v13.8,12.5 14,12.5 14,17.2 14.57,17.77 IC12.15
MCP-BT4  (via drill 0.35)
  Top 0.254: D7.2 17,67.3 v17,64.73
  Top 0.305: v16,12.5 16,10.12 RN3.1
  Route2 0.254: v17,64.73 16.48,64.22 16.48,63.71 15.91,63.14 15.07,63.14 14.89,63.32 14.09,63.32 13.51,62.74 13.51,61.81 11.6,59.9 11.6,16.9 v16,12.5
  Bottom 0.305: v16,12.5 16,16.7 17.11,17.81 IC12.17
N$1
  Top 0.406: NEOPIXEL1.4 6.6,55.8 R1.1
N$2
  Top 0.406: NEOPIXEL2.4 3.08,47.48 NEOPIXEL1.2
N$3
  Top 0.406: NEOPIXEL2.2 10.72,39.88 NEOPIXEL3.4
N$4
  Top 0.406: NEOPIXEL3.2 17.92,47.52 NEOPIXEL4.4
N$5
  Top 0.406: NEOPIXEL4.2 15.61,52.71 17.4,54.5 29.3,54.5 NEOPIXEL5.4
N$6
  Top 0.508: NEOPIXEL9.4 7.6,32.8 19.4,32.8 36.78,50.18 36.78,52.61 NEOPIXEL8.2
N$7
  Top 0.406: NEOPIXEL13.4 29.9,31.1 17.8,31.1 15.41,28.71 NEOPIXEL12.2
N$8
  Top 0.406: NEOPIXEL5.2 29.49,47.59 27.08,45.18 NEOPIXEL6.4
N$9
  Top 0.406: NEOPIXEL9.2 2.68,23.08 2.68,19.11 NEOPIXEL10.4
N$10
  Top 0.406: NEOPIXEL14.4 27.88,19.51 27.88,24.28 NEOPIXEL13.2
N$11
  Top 0.406: NEOPIXEL6.2 35.3,39.3 38.5,39.3 NEOPIXEL7.4
N$12
  Top 0.406: NEOPIXEL10.2 10.72,15.88 NEOPIXEL11.4
N$13
  Top 0.406: NEOPIXEL14.2 34.72,15.88 NEOPIXEL15.4
N$14
  Top 0.406: NEOPIXEL7.2 41.92,47.52 NEOPIXEL8.4
N$15
  Top 0.406: NEOPIXEL11.2 17.92,23.52 NEOPIXEL12.4
N$16
  Top 0.406: NEOPIXEL15.2 41.92,23.52 NEOPIXEL16.4
N$17
  Top 1.016: U$1.5 U$1.4
  Route2 1.27: U$1.4 11.44,64.54 12.8,65.9 33.94,65.9 JP1.3
N$18
  Top 1.27: JP1.1 40.72,59.96 J1.2
N$20
  Bottom 1.016: IC2.2 26.9,35 D8.1 26.8,33.2 31,29 41.2,29 42.35,27.85 L1.1
N$21
  Top 0.254: IC3.5 24.2,3.6 24.5,3.3 24.5,2.2 | 24.5,2.2 25.05,1.65 R2.2 | 24.5,2.2 23.9,1.6 C11.1
RST  (via drill 0.35)
  Top 0.254: RN1.1 31.07,9.53 v33.8,6.8
  Route15 0.305: v3,13.9 6.1,10.8 v12,10.8 13,9.8 20.1,9.8 22.6,7.3 22.6,4.6 23.4,3.8 29.7,3.8 32.7,6.8 v33.8,6.8
  Bottom 0.305: IC1.RST 36.13,4.47 v33.8,6.8 | RESET.1 v3,13.9 | v12,10.8 12.03,10.77 IC12.6
RX  (via drill 0.35)
  Route15 0.305: JP2.2 5.97,8.47 19.02,8.47 20.06,7.43 20.06,5.28 22.49,2.84 30.5,2.84 32.51,4.85 33.85,4.85 35.2,6.2 35.2,13.5 v34.1,14.6
  Bottom 0.305: v34.1,14.6 34.1,17.06 IC1.RXD/IO3
SCL  (via drill 0.35)
  Top 0.254: v14.4,3.2 13.94,2.73 HM1.4 | IC3.6 23.88,4.6 v24.24,4.96 24.24,6.61 R21.1
  Route2 0.254: v14.4,3.2 14.4,2.4 15.6,1.2 20.57,1.2 24.24,4.87 v24.24,4.96 24.19,4.91 18.4,10.7 v18.9,11.2
  Route2 0.305: v32.1,15 32.1,14.33 29.37,11.6 19.3,11.6 v18.9,11.2
  Bottom 0.254: IC12.1 18.38,10.68 v18.9,11.2 | X1.1 8.4,6 9.1,5.3 9.1,2.98 10.58,1.5 13.1,1.5 14.4,2.8 v14.4,3.2
  Bottom 0.305: IC1.IO5 32.13,15.03 v32.1,15
SDA  (via drill 0.35)
  Top 0.254: IC3.4 23.4,3.1 22.4,4.1 22.4,4.9 21.9,5.4 | 21.9,5.4 R22.1 | 21.9,5.4 21.86,5.44 v21.86,5.46 | v9.76,1.39 9.96,1.19 13.89,1.19 14.59,1.89 HM1.3
  Route2 0.254: v17.8,11.2 17.8,10.52 21.86,6.46 v21.86,5.46 21.86,3.16 20.31,1.61 16.19,1.61 15.06,2.74 15.06,3.47 14.67,3.86 14.13,3.86 13.74,3.47 13.74,2.04 13.09,1.39 v9.76,1.39
  Route2 0.305: v30.2,14.1 30.2,13.3 29.02,12.12 18.52,12.12 17.8,11.4 v17.8,11.2
  Bottom 0.254: IC12.2 17.11,10.51 v17.8,11.2 | X1.2 8.5,5 8.69,4.81 8.69,2.81 9.76,1.75 v9.76,1.39
  Bottom 0.305: IC1.IO4 30.13,14.17 v30.2,14.1
TX  (via drill 0.35)
  Route15 0.305: JP2.1 4.16,9.2 19.7,9.2 20.8,8.1 20.8,5.4 22.9,3.3 30.1,3.3 32.2,5.4 33.5,5.4 34.6,6.5 34.6,12.4 v34.2,12.8
  Bottom 0.305: v34.2,12.8 36.13,14.73 IC1.TXD/IO1
VCC  (via drill 0.35, 0.55, 0.75)
  Top 0.254: R21.2 24.18,8.55 25.4,7.33 RN2.8 RN2.7 | RN2.7 RN2.6 RN2.5 | RN2.7 RN1.6 RN1.7 RN1.8 | HM1.8 15.88,3.98 15.76,3.86 15.2,3.86 | HM1.5 13.94,4.17 14.24,3.86 14.6,3.86 | 15.2,3.86 14.6,3.86 | HM1.6 14.59,3.87 14.6,3.86 | 15.2,3.86 15.23,3.82 HM1.2 15.23,1.86 15.49,1.61 18.91,1.61 19.97,2.67 | C4.2 31.3,25.15 31.3,26.7 29.8,28.2 27.17,28.2 NEOPIXEL13.1 | C8.2 37.7,25.15 37.7,27.2 39.09,28.59 NEOPIXEL16.1
  Top 0.305: RN3.5 RN3.6 RN3.7 RN3.8 18.85,8.78 20.12,7.5 | 5.8,28.5 5.8,28.3 7.2,26.9 7.2,25.05 C3.2 5.95,24.35 3.7,22.1 3.7,20.4 5.91,18.19 NEOPIXEL10.1 | NEOPIXEL12.1 12.82,31.12 11.1,29.4 11.1,28.88 14.5,25.48 C7.2 13.6,23.45 13.6,21 15.89,18.71 NEOPIXEL11.1 | 29.8,52.5 31.6,50.7 31.6,49.45 C2.2 | NEOPIXEL8.1 39.09,52.59 37.9,51.4 37.9,48.95 C10.2 35.75,48.35 30.1,42.7 30.1,39.88 | C1.2 6.5,49 7.4,49.9 7.4,51 5.85,52.55 | C9.2 14.5,49.5 11.28,52.72 11.28,53.16 11.3,53.17 11.3,54.37 | v32.83,4.1 32.08,3.35 R2.1 | IC3.1 20.46,4.1 20.12,4.44 20.12,2.82 19.97,2.67
  Top 0.61: U$3.3V3_1 23.14,52.29 NEOPIXEL5.1 29.59,52.29 29.8,52.5 32.42,55.12 NEOPIXEL8.1 | U$3.3V3_2 15.8,55.83 NEOPIXEL4.1 14.34,54.37 11.3,54.37 7.67,54.37 5.85,52.55 5.59,52.29 NEOPIXEL1.1 3.4,51.97 3.4,49.6 1.32,47.52 1.32,41.68 | NEOPIXEL7.1 41.92,38.1 | 41.92,38.1 41.92,33.95 40.29,32.31 | 40.29,32.31 NEOPIXEL16.1 | NEOPIXEL6.1 30.1,39.88 32.58,39.88 v32.6,39.9 34.4,38.1 41.92,38.1 | NEOPIXEL15.1 43.6,20.4 43.6,29 40.29,32.31 | 22.9,17.8 22.7,17.8 v20.2,17.8 18.83,17.8 NEOPIXEL11.1 | 22.9,16.7 29.1,16.7 NEOPIXEL14.1 | 12.47,14.1 7.7,14.1 NEOPIXEL10.1 5.9,15.9 4.2,15.9 1.32,18.78 1.32,30.05 | NEOPIXEL12.1 8.42,31.12 5.8,28.5 5.59,28.29 NEOPIXEL9.1 1.32,30.05 | NEOPIXEL3.1 17.92,40.62 15.4,38.1 7.7,38.1 NEOPIXEL2.1 5.63,39.6 3.4,39.6 1.32,41.68 | 1.32,30.05 1.32,41.68 | v22.9,10.3 22.9,8.6 | 22.9,8.6 22.95,8.55 R21.2 | 22.9,8.6 21.95,8.6 R22.2 21.17,8.55 20.12,7.5 20.12,4.44
  Top 0.813: v4.9,3.83 4.86,3.87 4.86,6.49 12.28,13.9 | 12.28,13.9 12.47,14.1 | 12.28,13.9 22.9,13.9
  Top 1.016: v24.3,29.6 25.61,28.29 25.81,28.29 | 25.81,28.29 NEOPIXEL13.1 | 25.81,28.29 26.7,27.4 26.7,21.8 22.7,17.8 | v22.9,10.3 22.9,13.9 22.9,16.7 22.9,17.8
  Bottom 0.508: IC12.18 18.38,18.32 19.1,17.6 20,17.6 v20.2,17.8
  Bottom 0.61: 23,6.8 30.6,6.8 32.83,4.57 v32.83,4.1 32.83,3.59 32.13,2.89 IC1.EN
  Bottom 0.813: X1.3 5.07,4 v4.9,3.83
  Bottom 1.016: v22.9,10.3 23,10.2 23,6.8 23,4.3 22.13,3.43 IC1.VCC | IC2.4 32.2,38.4 32.6,38.8 v32.6,39.9 32.6,41.4 | C6.1 25.7,56.95 | 32.6,41.4 25.7,48.3 25.7,56.95 | L1.2 30.95,24.7 24.9,30.75 | 24.9,30.75 24.4,31.25 24.4,40.4 25.4,41.4 32.6,41.4 | 25.7,56.95 24.58,55.83 U$3.3V3_2 U$3.3V3_1 | 24.9,30.75 24.9,30.2 v24.3,29.6
VDD
  Bottom 1.27: JP1.2 33.6,62.5 31.6,60.5 31.6,51.05 | 31.6,51.05 C5.1 | IC2.1 33.3,33.3 34.9,34.9 34.9,47.75 31.6,51.05

### Text on the board
tPlace: 4.7k | 4.7k | 1k | 1uf
bPlace: LSC | EXT | Austin's Creations | Smart / Switch | V2.0.0 | 7-34v input | TX